# Altium schematic sheet sdcard_emmc.SchDoc
size A4
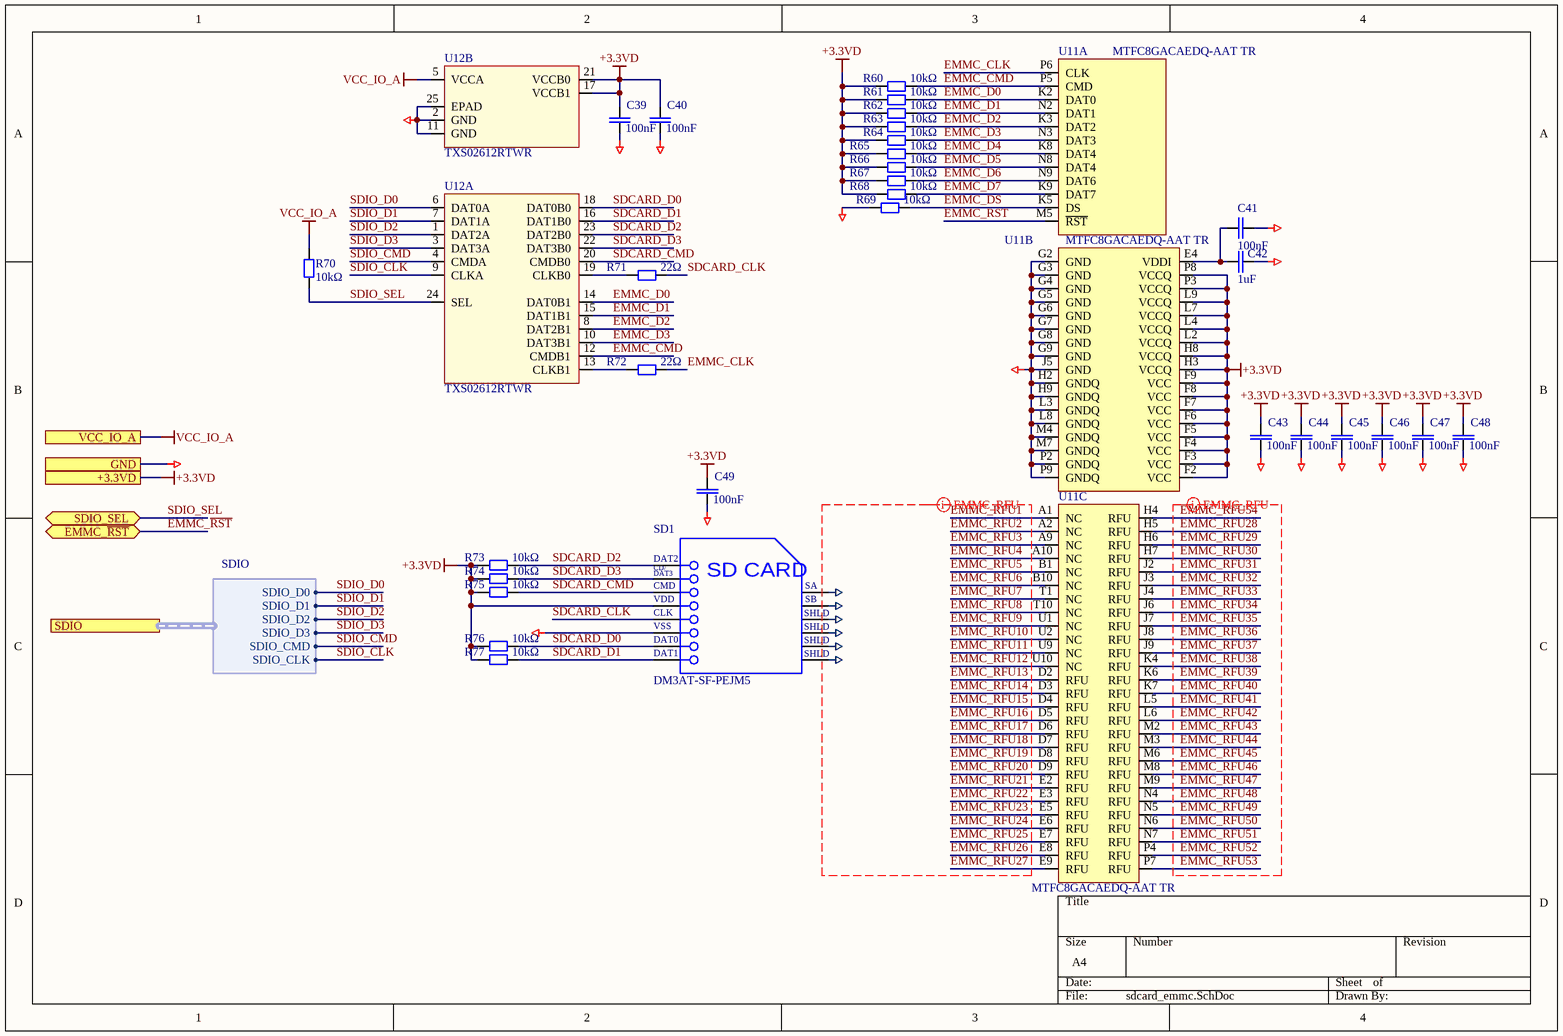
[diagram p0: sdcard_emmc.SchDoc]

## Parts
C39  100nF  [CAPC1608N]
C40  100nF  [CAPC1608N]
C41  100nF  [CAPC1608N]
C42  1uF  [CAPC2012N]
C43  100nF  [CAPC1608N]
C44  100nF  [CAPC1608N]
C45  100nF  [CAPC1608N]
C46  100nF  [CAPC1608N]
C47  100nF  [CAPC1608N]
C48  100nF  [CAPC1608N]
C49  100nF  [CAPC1608N]
R60  10kΩ  [RESC2012N]
R61  10kΩ  [RESC2012N]
R62  10kΩ  [RESC2012N]
R63  10kΩ  [RESC2012N]
R64  10kΩ  [RESC2012N]
R65  10kΩ  [RESC2012N]
R66  10kΩ  [RESC2012N]
R67  10kΩ  [RESC2012N]
R68  10kΩ  [RESC2012N]
R69  10kΩ  [RESC2012N]
R70  10kΩ  [RESC2012N]
R71  22Ω  [RESC1608N]
R72  22Ω  [RESC1608N]
R73  10kΩ  [RESC2012N]
R74  10kΩ  [RESC2012N]
R75  10kΩ  [RESC2012N]
R76  10kΩ  [RESC2012N]
R77  10kΩ  [RESC2012N]
SD1  DM3AT-SF-PEJM5  [SD_HRS-DM3AT-8_V]
U11  MTFC8GACAEDQ-AAT TR  [BGA100C100P10X17_1400X1800X120]  (parts A,B,C of 3)
U12  TXS02612RTWR  [QFN50P400X400X80-25N-S245]  (parts A,B of 2)

## Ports
+3.3VD, EMMC_~{RST} (bidir), GND, SDIO (harness SDIO), SDIO_SEL (bidir), VCC_IO_A

## Harnesses
SDIO: SDIO_D0, SDIO_D1, SDIO_D2, SDIO_D3, SDIO_CMD, SDIO_CLK

## Nets
+3.3VD: C39.1 C40.1 C43.1 C44.1 C45.1 C46.1 C47.1 C48.1 C49.1 R60.1 R61.1 R62.1 R63.1 R64.1 R65.1 R66.1 R67.1 R68.1 R73.1 R74.1 R75.1 R76.1 R77.1 SD1.4(VDD) U11.F2(VCC) U11.F3(VCC) U11.F4(VCC) U11.F5(VCC) U11.F6(VCC) U11.F7(VCC) U11.F8(VCC) U11.F9(VCC) U11.H3(VCCQ) U11.H8(VCCQ) U11.L2(VCCQ) U11.L4(VCCQ) U11.L7(VCCQ) U11.L9(VCCQ) U11.P3(VCCQ) U11.P8(VCCQ) U12.17(VCCB1) U12.21(VCCB0) ; port +3.3VD
GND: C39.2 C40.2 C41.2 C42.1 C43.2 C44.2 C45.2 C46.2 C47.2 C48.2 C49.2 R69.1 SD1.6(VSS) U11.G2(GND) U11.G3(GND) U11.G4(GND) U11.G5(GND) U11.G6(GND) U11.G7(GND) U11.G8(GND) U11.G9(GND) U11.H2(GNDQ) U11.H9(GNDQ) U11.J5(GND) U11.L3(GNDQ) U11.L8(GNDQ) U11.M4(GNDQ) U11.M7(GNDQ) U11.P2(GNDQ) U11.P9(GNDQ) U12.2(GND) U12.11(GND) U12.25(EPAD) ; port GND
SDEPAD1: SD1.9(SA)
SDEPAD2: SD1.10(SB)
SDEPAD3: SD1.11(SHLD)
SDEPAD4: SD1.13(SHLD)
SDEPAD5: SD1.12(SHLD)
SDEPAD6: SD1.14(SHLD)
VCC_IO_A: R70.2 U12.5(VCCA) ; port VCC_IO_A
EMMC_CLK: R72.2 U11.P6(CLK)
EMMC_CMD: R60.2 U11.P5(CMD) U12.12(CMDB1)
EMMC_D0: R61.2 U11.K2(DAT0) U12.14(DAT0B1)
EMMC_D1: R62.2 U11.N2(DAT1) U12.15(DAT1B1)
EMMC_D2: R63.2 U11.K3(DAT2) U12.8(DAT2B1)
EMMC_D3: R64.2 U11.N3(DAT3) U12.10(DAT3B1)
EMMC_D4: R65.2 U11.K8(DAT4)
EMMC_D5: R66.2 U11.N8(DAT4)
EMMC_D6: R67.2 U11.N9(DAT6)
EMMC_D7: R68.2 U11.K9(DAT7)
EMMC_DS: R69.2 U11.K5(DS)
EMMC_~{RST}: U11.M5(~{RST}) ; port EMMC_~{RST}
EMMC_RFU1: U11.A1(NC)
EMMC_RFU2: U11.A2(NC)
EMMC_RFU3: U11.A9(NC)
EMMC_RFU4: U11.A10(NC)
EMMC_RFU5: U11.B1(NC)
EMMC_RFU6: U11.B10(NC)
EMMC_RFU7: U11.T1(NC)
EMMC_RFU8: U11.T10(NC)
EMMC_RFU9: U11.U1(NC)
EMMC_RFU10: U11.U2(NC)
EMMC_RFU11: U11.U9(NC)
EMMC_RFU12: U11.U10(NC)
EMMC_RFU13: U11.D2(RFU)
EMMC_RFU14: U11.D3(RFU)
EMMC_RFU15: U11.D4(RFU)
EMMC_RFU16: U11.D5(RFU)
EMMC_RFU17: U11.D6(RFU)
EMMC_RFU18: U11.D7(RFU)
EMMC_RFU19: U11.D8(RFU)
EMMC_RFU20: U11.D9(RFU)
EMMC_RFU21: U11.E2(RFU)
EMMC_RFU22: U11.E3(RFU)
EMMC_RFU23: U11.E5(RFU)
EMMC_RFU24: U11.E6(RFU)
EMMC_RFU25: U11.E7(RFU)
EMMC_RFU26: U11.E8(RFU)
EMMC_RFU27: U11.E9(RFU)
EMMC_RFU28: U11.H5(RFU)
EMMC_RFU29: U11.H6(RFU)
EMMC_RFU30: U11.H7(RFU)
EMMC_RFU31: U11.J2(RFU)
EMMC_RFU32: U11.J3(RFU)
EMMC_RFU33: U11.J4(RFU)
EMMC_RFU34: U11.J6(RFU)
EMMC_RFU35: U11.J7(RFU)
EMMC_RFU36: U11.J8(RFU)
EMMC_RFU37: U11.J9(RFU)
EMMC_RFU38: U11.K4(RFU)
EMMC_RFU39: U11.K6(RFU)
EMMC_RFU40: U11.K7(RFU)
EMMC_RFU41: U11.L5(RFU)
EMMC_RFU42: U11.L6(RFU)
EMMC_RFU43: U11.M2(RFU)
EMMC_RFU44: U11.M3(RFU)
EMMC_RFU45: U11.M6(RFU)
EMMC_RFU46: U11.M8(RFU)
EMMC_RFU47: U11.M9(RFU)
EMMC_RFU48: U11.N4(RFU)
EMMC_RFU49: U11.N5(RFU)
EMMC_RFU50: U11.N6(RFU)
EMMC_RFU51: U11.N7(RFU)
EMMC_RFU52: U11.P4(RFU)
EMMC_RFU53: U11.P7(RFU)
EMMC_RFU54: U11.H4(RFU)
SDCARD_CLK: R71.2 SD1.5(CLK)
SDCARD_CMD: R75.2 SD1.3(CMD) U12.20(CMDB0)
SDCARD_D0: R76.2 SD1.7(DAT0) U12.18(DAT0B0)
SDCARD_D1: R77.2 SD1.8(DAT1) U12.16(DAT1B0)
SDCARD_D2: R73.2 SD1.1(DAT2) U12.23(DAT2B0)
SDCARD_D3: R74.2 SD1.2(CD/DAT3) U12.22(DAT3B0)
SDIO_CLK: U12.9(CLKA) ; port SDIO.SDIO_CLK
SDIO_CMD: U12.4(CMDA) ; port SDIO.SDIO_CMD
SDIO_D0: U12.6(DAT0A) ; port SDIO.SDIO_D0
SDIO_D1: U12.7(DAT1A) ; port SDIO.SDIO_D1
SDIO_D2: U12.1(DAT2A) ; port SDIO.SDIO_D2
SDIO_D3: U12.3(DAT3A) ; port SDIO.SDIO_D3
SDIO_SEL: R70.1 U12.24(SEL) ; port SDIO_SEL
NetC41_1: C41.1 C42.2 U11.E4(VDDI)
NetR71_1: R71.1 U12.19(CLKB0)
NetR72_1: R72.1 U12.13(CLKB1)

## Layout directives
differential pair; net class EMMC_RFU: EMMC_RFU1, EMMC_RFU2, EMMC_RFU3, EMMC_RFU4, EMMC_RFU5, EMMC_RFU6, EMMC_RFU7, EMMC_RFU8, EMMC_RFU9, EMMC_RFU10, EMMC_RFU11, EMMC_RFU12, EMMC_RFU13, EMMC_RFU14, EMMC_RFU15, EMMC_RFU16, EMMC_RFU17, EMMC_RFU18, EMMC_RFU19, EMMC_RFU20, EMMC_RFU21, EMMC_RFU22, EMMC_RFU23, EMMC_RFU24, EMMC_RFU25, EMMC_RFU26, EMMC_RFU27, EMMC_RFU28, EMMC_RFU29, EMMC_RFU30, EMMC_RFU31, EMMC_RFU32, EMMC_RFU33, EMMC_RFU34, EMMC_RFU35, EMMC_RFU36, EMMC_RFU37, EMMC_RFU38, EMMC_RFU39, EMMC_RFU40, EMMC_RFU41, EMMC_RFU42, EMMC_RFU43, EMMC_RFU44, EMMC_RFU45, EMMC_RFU46, EMMC_RFU47, EMMC_RFU48, EMMC_RFU49, EMMC_RFU50, EMMC_RFU51, EMMC_RFU52, EMMC_RFU53, EMMC_RFU54, SDEPAD1, SDEPAD2, SDEPAD3, SDEPAD4, SDEPAD5, SDEPAD6

## Notes on the sheet
- (in symbol DM3AT-SF-PEJM5) CD/; DAT3; SD CARD

## Library data of the parts
C39-C41 C43-C49 = CAPC: Generic ceramic SMD capacitor; Pkg: 0603; Maintainer: Evgeniy Kotov; SMD Solders: 2; THD Solders: 0; PartField: 100nF; Last Change Data: 06.03.2017; Release Date: 06.03.2017; Value: 100nF
C42 = CAPC: Generic ceramic SMD capacitor; Pkg: 0805; Maintainer: Evgeniy Kotov; SMD Solders: 2; THD Solders: 0; Voltage Rating: 10V; PartField: 1uF; Last Change Data: 06.03.2017; Release Date: 06.03.2017; Value: 1uF
R60-R70 R73-R77 = RESC: Resistor, Generic, SMD; Pkg: 0805; Maintainer: Evgeniy Kotov; SMD Solders: 2; THD Solders: 0; PartField: 10kΩ; Release Date: 06.03.2017; Last Change Data: 09.03.2017; Value: 10kΩ
R71 R72 = RESC: Resistor, Generic, SMD; Pkg: 0603; Maintainer: Evgeniy Kotov; SMD Solders: 2; THD Solders: 0; PartField: 22Ω; Release Date: 06.03.2017; Last Change Data: 09.03.2017; Value: 22Ω
SD1 = DM3AT-SF-PEJM5: Micro SD Card Connector, 0.5 A, 125 V, -25 to 85 degC, 8-Pin SMD, RoHS, Tape and Reel; Manufacturer: Hirose Electric; Featured Product: DM3ATSeries; HTML Datasheet: DM3SeriesmicroSD.html; Other Names: HR1964DKR; Connector Type: ConnectorandEjector; Insertion, Removal Method: PushIn,PushOut; Card Type: SecureDigital-microSD™; Online Catalog: DM3Series; Number of Positions: 10(8+2); Product Training Modules: DM3SeriesmicroSDCardSockets; Pkg: SD card hlder; SMD Solders: 14; THD Solders: 0; Manufacturer URL: https://www.hirose.com; Contact Finish: Gold; Family: MemoryConnectors-PCCardSockets; Package Reference: DM3AT-8; Category: Connectors,Interconnects; Features: Switch; Mounting Type: SurfaceMount,RightAngle; Datasheet Version: Jun-10; Package Description: 8-Pin Surface Mount Device, Body 16.15 x 13.85 mm, Pitch 1.1 mm; Standard Package: 1; Contact Finish Thickness: -; Datasheet URL: https://ciiva.com/datasheet-click-46418261?src=ciiva&sig=4019062a; Mounting Feature: Normal,Standard-Top; Series: DM3; Packaging: Digi-Reel; Package URL: https://www.hirose.com/product/en/download_file/key_name/DM3/category/Catalog/doc_file_id/49662/?file_category_id=4&item_id=195&is_series=1; Ejector Side: -; Value: DM3AT-SF-PEJM5; Vendor: Hirose Electric; PartField: DM3AT-SF-PEJM5
U11 = MTFC32GAKAENA: Pkg: LBGA-100; SMD Solders: 100; THD Solders: 0; Value: MTFC8GACAEDQ-AAT TR; PartField: MTFC8GACAEDQ-AAT TR
U12 = TXS02612_RTW_24: IC SDIO PORT EXPANDER AND LEVEL SHIFTER; Vendor: Texas Instruments; PACKAGE_DESIGNATOR: RTW; PIN_COUNT: 24; FAMILY_NAME: APPLICATION SPECIFIC (COMPACT FLASH, SD, MMC, I2C); INDUSTRY_STD_PKG_TYPE: QFN; Pkg: QFN-24EP; SMD Solders: 25; THD Solders: 0; Manufacturer_Part_Number: txs02612_rtw_24; GENERIC_PART_NUMBER: TXS02612RTWR; Datasheet URL: http://www.ti.com/lit/gpn/TXS02612; Manufacturer: Texas Instruments; RefDes: RefDes; Type: DEV; Value: TXS02612RTWR; PartField: TXS02612RTWR